# EAGLE design SparkFun_Qwiic_Presence_STHS34PF80 (EAGLE 9.6.2)
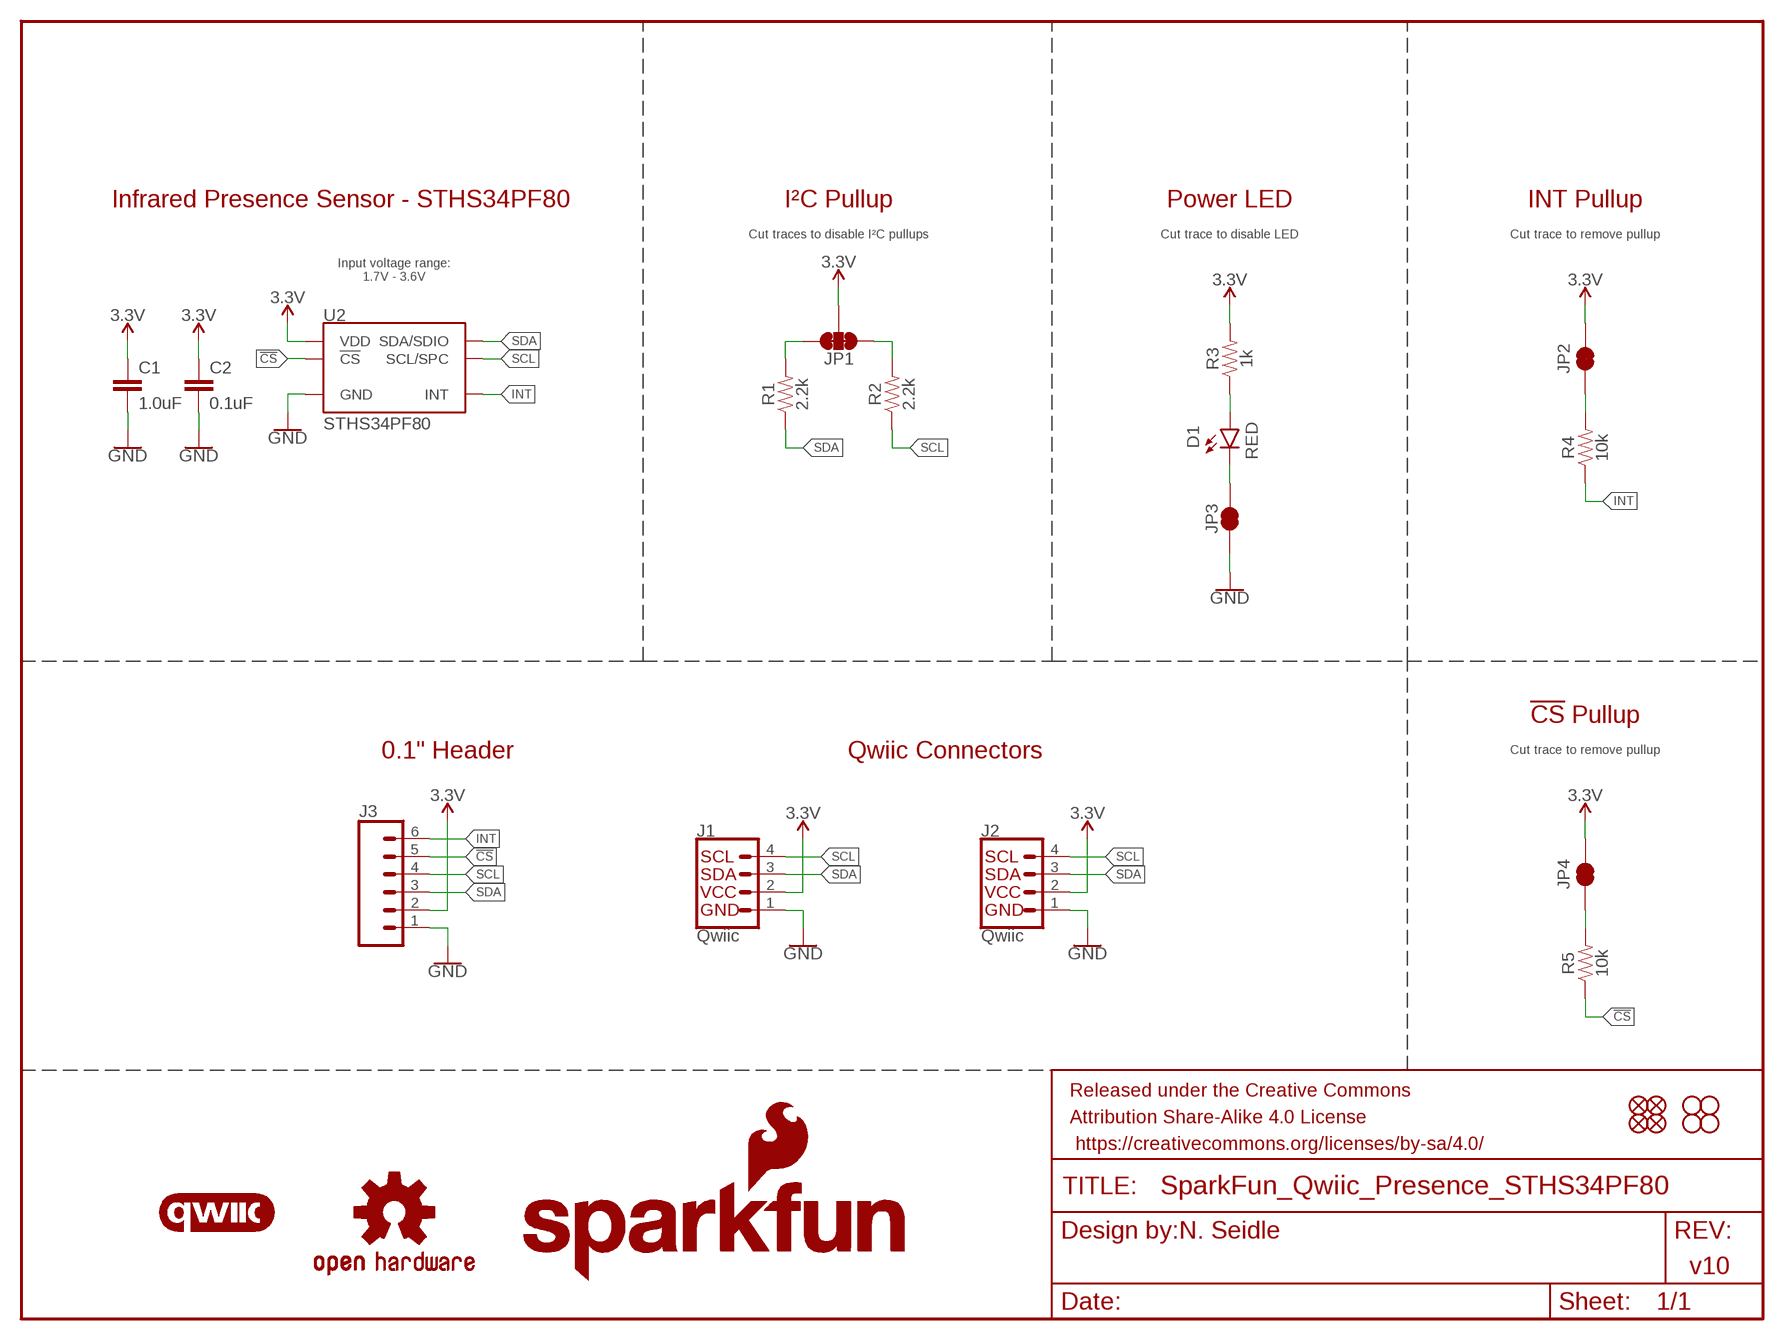
[diagram p0: schematic, sheet 1]

## Parts
C1  1.0uF  1.0UF-0603-16V-10%  [0603]
C2  0.1uF  0.1UF-0603-25V-(+80/-20%)  [0603]
D1  RED  LED-RED0603  [LED-0603]
FD1  FIDUCIAL1X2  [FIDUCIAL-1X2]
FD2  FIDUCIAL1X2  [FIDUCIAL-1X2]
FD3  FIDUCIAL1X2  [FIDUCIAL-1X2]
FD4  FIDUCIAL1X2  [FIDUCIAL-1X2]
FRAME2  FRAME-LETTER  [CREATIVE_COMMONS]
H1  STAND-OFF  [STAND-OFF]
H2  STAND-OFF  [STAND-OFF]
H3  STAND-OFF  [STAND-OFF]
H4  STAND-OFF  [STAND-OFF]
J1  Qwiic  QWIIC_CONNECTORJS-1MM  [JST04_1MM_RA]
J2  Qwiic  QWIIC_CONNECTORJS-1MM  [JST04_1MM_RA]
J3  CONN_06NO_SILK_NO_POP  [1X06_NO_SILK]
JP1  JUMPER-SMT_3_2-NC_TRACE_SILK  [SMT-JUMPER_3_2-NC_TRACE_SILK]
JP2  JUMPER-SMT_2_NC_TRACE_SILK  [SMT-JUMPER_2_NC_TRACE_SILK]
JP3  JUMPER-SMT_2_NC_TRACE_SILK  [SMT-JUMPER_2_NC_TRACE_SILK]
JP4  JUMPER-SMT_2_NC_TRACE_SILK  [SMT-JUMPER_2_NC_TRACE_SILK]
LOGO1  OSHW-LOGOS  [OSHW-LOGO-S]
LOGO2  SFE_LOGO_NAME_FLAME.1_INCH  [SFE_LOGO_NAME_FLAME_.1]
LOGO3  QWIIC_LOGO_CONNECTOR  [QWIIC_5.5MM]
LOGO4  SFE_LOGO_NAME8_MM  [SFE_LOGO_NAME_8MM]
LOGO6  SFE_LOGO_FLAME.1_INCH  [SFE_LOGO_FLAME_.1]
R1  2.2k  2.2KOHM-0603-1/10W-1%  [0603]
R2  2.2k  2.2KOHM-0603-1/10W-1%  [0603]
R3  1k  1KOHM-0603-1/10W-1%  [0603]
R4  10k  10KOHM-0603-1/10W-1%  [0603]
R5  10k  10KOHM-0603-1/10W-1%  [0603]
U2  STHS34PF80  [OLGA-10L]

## Nets
3.3V: C1.1 C2.1 J1.2 J2.2 J3.2 JP1.2 JP2.2 JP4.2 R3.2 U2.6(VDD) U2.9(VDD)
!CS!: J3.5 R5.1 U2.3(!CS!)
GND: C1.2 C2.2 J1.1 J2.1 J3.1 JP3.1 U2.2(GND) U2.7(GND) U2.8(GND)
INT: J3.6 R4.1 U2.10(INT)
N$1: D1.C JP3.2
N$2: JP1.3 R1.2
N$3: JP1.1 R2.2
N$4: D1.A R3.1
N$5: JP2.1 R4.2
N$6: JP4.1 R5.2
SCL: J1.4 J2.4 J3.4 R2.1 U2.1(SCL/SPC)
SDA: J1.3 J2.3 J3.3 R1.1 U2.4(SDA/SDIO)

## Notes on the sheet
- Infrared Presence Sensor - STHS34PF80 | I²C Pullup | Power LED | INT Pullup
- Cut traces to disable I²C pullups | Cut trace to disable LED | Cut trace to remove pullup
- Input voltage range:
  1.7V - 3.6V
- !CS! Pullup
- 0.1" Header | Qwiic Connectors | Cut trace to remove pullup
- N. Seidle
- v10

## Library data of the parts
C1 = SparkFun-Capacitors:1.0UF: 1µF ceramic capacitors A capacitor is a passive two-terminal electrical component used to store electrical energy temporarily in an electric field.; PROD_ID: CAP-00868
C2 = SparkFun-Capacitors:0.1UF: 0.1µF ceramic capacitors A capacitor is a passive two-terminal electrical component used to store electrical energy temporarily in an electric field.; PROD_ID: CAP-00810
D1 = SparkFun-LED:LED-RED: Red SMD LED Used in manufacturing of most products at SparkFun Packages: 0603 - SMD 0603 package [Product Link] <http://docs.avagotech.com/docs/AV02-0551EN> 0603 SMART - SMD 0603 SMART package ( more efficient and expensive)[Product Link] <http://www.osram-os.com/Graphics/XPic2/00077099_0.pdf> 1206 - SMD1206 package [Product Link] <https://www.sparkfun.com/datasheets/DevTools/LilyPad/Q150OVS4.pdff> SparkFun Products: Pro Mini 328 -5V <https://www.sparkfun.com/products/821> RedBoard <https://www.sparkfun.com/products/12757> IOIO-OTG <https://www.sparkfun.com/products/13613>; PROD_ID: DIO-00819
FD1-FD4 = SparkFun-Aesthetics:FIDUCIAL: Fiducial Alignment Points Point-of-reference for pick-and-place machines and other optical instruments.
FRAME2 = SparkFun-Aesthetics:FRAME-LETTER: Schematic Frame - Letter Standard 8.5x11 US Letter frame
H1-H4 = SparkFun-Hardware:STAND-OFF: Stand Off Drill holes for mechanically mounting via screws, standoffs, etc. Note: Use the keepout ring to avoid running the screw head into surrounding components. Variant Overviews STAND-OFF - Mechanical footprint for a #4 phillips button head screw. STAND-OFF-TIGHT - Mechanical footprint for a #4 phillips button head screw, Example SparkFun Products Screw - Phillips Head (1/4", 4-40, 10 pack) <https://www.sparkfun.com/products/10453> (PRT-10453) Screw - Phillips Head (1/2", 4-40, 10 pack) <https://www.sparkfun.com/products/10452> (PRT-10452) Screw - Phillips Head (3/4", 4-40, 10 pack) <https://www.sparkfun.com/products/10451> (PRT-10451) Screw - Phillips Head (1", 4-40, 10 pack) <https://www.sparkfun.com/products/10450> (PRT-10450)
J1 J2 = SparkFun-Connectors:QWIIC_CONNECTOR: SparkFun I2C Standard Qwiic Connector An SMD 1mm pitch JST connector makes it easy and quick (get it? Qwiic?) to connect I2C devices to each other. The Qwiic system <http://www.sparkfun.com/qwiic> enables fast and solderless connection between popular platforms and various sensors and actuators. We carry 200mm <https://www.sparkfun.com/products/14204>, 100mm <https://www.sparkfun.com/products/14205>, 50mm <https://www.sparkfun.com/products/14206>, and breadboard friendly <https://www.sparkfun.com/products/14207> Qwiic cables. We also offer 10 pcs strips <https://www.sparkfun.com/products/14323> the SMD connectors.; PROD_ID: CONN-13694; VALUE: QWIIC_RIGHT_ANGLE
J3 = SparkFun-Connectors:CONN_06: Multi connection point. Often used as Generic Header-pin footprint for 0.1 inch spaced/style header connections On any of the 0.1 inch spaced packages, you can populate with these: Break Away Headers - Straight <https://www.sparkfun.com/products/116> (PRT-00116) Break Away Male Headers - Right Angle <https://www.sparkfun.com/products/553> (PRT-00553) Female Headers <https://www.sparkfun.com/products/115> (PRT-00115) Break Away Headers - Machine Pin <https://www.sparkfun.com/products/117> (PRT-00117) Break Away Female Headers - Swiss Machine Pin <https://www.sparkfun.com/products/743> (PRT-00743) Arduino Stackable Header - 6 Pin <https://www.sparkfun.com/products/9280> (PRT-09280) Screw Terminals 2.54mm Pitch (6-Pin) <https://www.sparkfun.com/products/16499> (PRT-16499) For SCREWTERMINALS and SPRING TERMINALS visit here: Screw Terimnals on SparkFun.com <https://www.sparkfun.com/search/results?term=Screw+Terminals> (5mm/3.5mm/2.54mm spacing) This device is also useful as a general connection point to wire up your design to another part of your project. Our various solder wires solder well into these plated through hole pads. Hook-Up Wire - Assortment (Stranded, 22 AWG) <https://www.sparkfun.com/products/11375> (PRT-11375) Hook-Up Wire - Assortment (Solid Core, 22 AWG) <https://www.sparkfun.com/products/11367> (PRT-11367) View the entire wire category on our website here <https://www.sparkfun.com/categories/141>
JP1 = SparkFun-Jumpers:JUMPER-SMT_3_2-NC_TRACE: Normally closed trace jumper (2 of 2 connections) This jumper has a trace between all three pads so they are normally closed (NC). Use a razor knife to open the connection(s). For best results follow the IPC guidelines for cutting traces: Cutout at least 0.063 mm (0.005 in). Remove all loose material to clean up the cut area. Seal the cut with an approved epoxy. Reapply solder to reclose the connection(s).
JP2-JP4 = SparkFun-Jumpers:JUMPER-SMT_2_NC_TRACE: Normally closed trace jumper This jumper has a trace between two pads so it's normally closed (NC). Use a razor knife to open the connection. For best results follow the IPC guidelines for cutting traces: Cutout at least 0.063 mm (0.005 in). Remove all loose material to clean up the cut area. Seal the cut with an approved epoxy. Reapply solder to reclose the connection.
LOGO1 = SparkFun-Aesthetics:OSHW-LOGO: Open-Source Hardware (OSHW) Logo This logo indicates the piece of hardware it is found on incorporates a OSHW license and/or adheres to the definition of open source hardware found here: http://freedomdefined.org/OSHW
LOGO2 = SparkFun-Aesthetics:SFE_LOGO_NAME_FLAME: SparkFun Font Logo w/ Flame This is the SparkFun full logo. The logo on the schematic will always be the same size; the package variant is the height of the flame part of the logo. Default layer for the logo on the board is tSilk.
LOGO3 = SparkFun-Aesthetics:QWIIC_LOGO: Qwiic Logos for placement on schematic and PCB. The 5.5mm silk logo is best for placing next to Qwiic connector.
LOGO4 = SparkFun-Aesthetics:SFE_LOGO_NAME: SparkFun Font Logo This is the SparkFun name logo. The logo on the schematic will always be the same size; the package variant is the height of the flame part of the logo (or the height the flame would be, if it were drawn). Default layer for the logo on the board is tSilk.
LOGO6 = SparkFun-Aesthetics:SFE_LOGO_FLAME: SparkFun Flame Logo This is the SparkFun flame logo. The logo on the schematic will always be the same size; the package variant is the height of the flame. Default layer for the logo on the board is tSilk.
R1 R2 = SparkFun-Resistors:2.2KOHM: 2.2kΩ resistor A resistor is a passive two-terminal electrical component that implements electrical resistance as a circuit element. Resistors act to reduce current flow, and, at the same time, act to lower voltage levels within circuits. - Wikipedia; PROD_ID: RES-08272
R3 = SparkFun-Resistors:1KOHM: 1kΩ resistor A resistor is a passive two-terminal electrical component that implements electrical resistance as a circuit element. Resistors act to reduce current flow, and, at the same time, act to lower voltage levels within circuits. - Wikipedia; PROD_ID: RES-07856
R4 R5 = SparkFun-Resistors:10KOHM: 10kΩ resistor A resistor is a passive two-terminal electrical component that implements electrical resistance as a circuit element. Resistors act to reduce current flow, and, at the same time, act to lower voltage levels within circuits. - Wikipedia; PROD_ID: RES-00824
U2 = STHS34PF80:STHS34PF80: Bosch BMP384 Pressure Sensor Senses pressure from 300 hPa to 1250 hPa, sends data out over I2C or SPI; PROD_ID: IC-

## Board
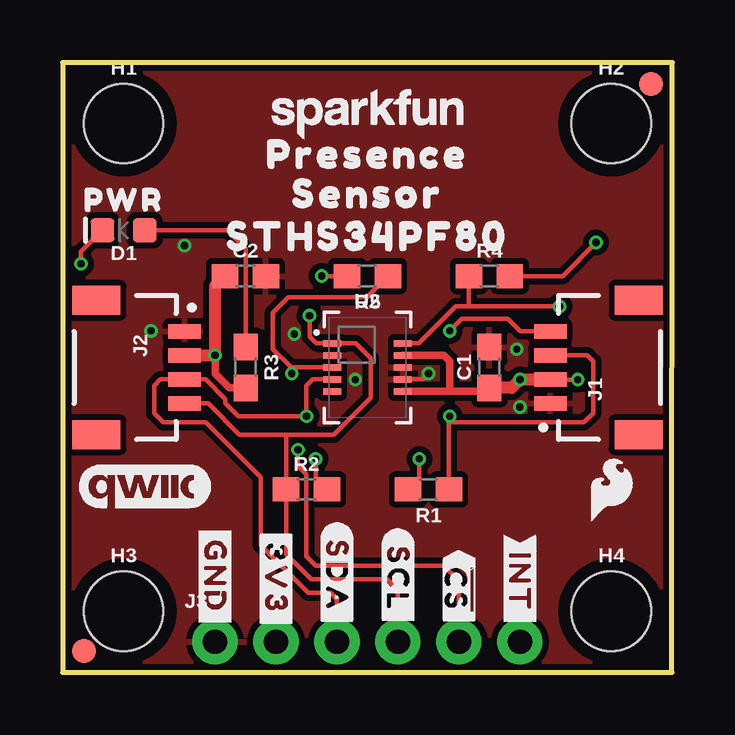
[diagram p1: board, top side]
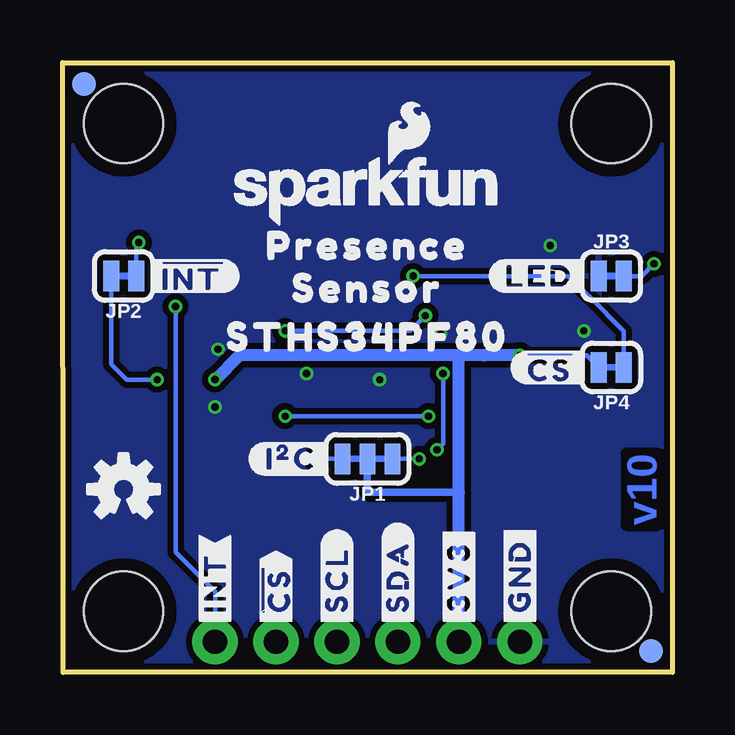
[diagram p2: board, bottom side, seen from below]

Size 25.4 x 25.4 mm. Coordinates in mm from the lower left corner, seen from the top.
Outline: 0,0 25.38,0 25.4,25.4 0,25.4 0,0
Copper layers (1*16): Top 0.035mm / dielectric 1.5mm / Bottom 0.035mm
Design rules "SparkFun-2-Layer-Minimum-JLCPCB": minimum track width 5mil, minimum drill 0.3mm, track to track 5mil, track to pad 5mil, pad to pad 5mil, via to via 5mil, smd to smd 5mil, copper to edge 7mil, drill to drill 7mil, minimum pad ring 5mil, minimum via ring 5mil, stop-mask expansion 2.5mil, vias tented up to drill 25mil, thermal gap 10mil

### Footprints (pad centres in the part's own frame; a part is rotated, then mirrored left to right if it is on the bottom)
0603 = smd 1.1 x 1: 1 -0.85,0; 2 0.85,0
LED-0603 = smd 1 x 1: A -0.877,0; C 0.877,0
FIDUCIAL-1X2 = smd 1 x 1: 1 0,0
STAND-OFF = hole 3.302: 0,0
JST04_1MM_RA = smd 0.6 x 1.35: 1 -1.5,0; 2 -0.5,0; 3 0.5,0; 4 1.5,0 | smd 1.2 x 2: NC1 2.8,-3.675; NC2 -2.8,-3.675
1X06_NO_SILK = drill 1.016 pad 1.88: 1 0,0; 2 2.54,0; 3 5.08,0; 4 7.62,0; 5 10.16,0; 6 12.7,0
SMT-JUMPER_3_2-NC_TRACE_SILK = smd 0.66 x 1.27: 1 -1.041,0; 2 0,0; 3 1.041,0
SMT-JUMPER_2_NC_TRACE_SILK = smd 0.66 x 1.27: 1 -0.521,0; 2 0.521,0
OLGA-10L = smd 0.75 x 0.285: 1 -1.475,1; 2 -1.475,0.5; 3 -1.475,0; 4 -1.475,-0.5; 5 -1.475,-1; 6 1.475,-1; 7 1.475,-0.5; 8 1.475,0; 9 1.475,0.5; 10 1.475,1

### Placement (x,y rotation side)
C1  17.78,12.7 90 top
C2  7.62,16.51 0 top
D1  2.54,18.41 180 top
FD1  0.89,0.89 0 bottom
FD2  0.89,0.89 0 top
FD3  24.51,24.51 0 bottom
FD4  24.51,24.51 0 top
FRAME2  -10.16,-29.21 0 top  (outside the outline)
H1  2.54,22.86 0 top
H2  22.86,22.86 0 top
H3  2.54,2.54 0 top
H4  22.86,2.54 0 top
J1  20.32,12.7 90 top
J2  5.08,12.7 270 top
J3  6.35,1.27 0 top
JP1  12.7,8.89 180 bottom
JP2  22.86,16.51 180 bottom
JP3  2.54,16.51 0 bottom
JP4  2.54,12.7 180 bottom
LOGO1  22.86,7.62 0 bottom
LOGO2  12.7,20.07 0 bottom
LOGO3  3.43,7.75 0 top
LOGO4  12.7,23.37 0 top
LOGO6  22.86,7.62 0 top
R1  15.24,7.62 180 top
R2  10.16,7.62 0 top
R3  7.62,12.7 270 top
R4  17.78,16.51 0 top
R5  12.7,16.51 180 top
U2  12.7,12.7 0 top
U$1  [#I�C#0]  17.65,8.89 0 bottom
U$2  [##CS##0]  16.51,1.78 90 bottom
U$3  [#3V3#0]  8.89,1.78 90 bottom
U$4  [#INT#1]  19.05,1.78 90 bottom
U$5  [STHS34PF800]  12.7,18.16 0 top
U$6  [STHS34PF800]  12.7,13.97 0 bottom
U$7  [PRESENCE0]  12.7,21.59 0 top
U$8  [PRESENCE0]  12.7,17.78 0 bottom
U$9  [PWR11]  2.54,19.68 0 top
U$10  [##INT##0]  21.97,16.51 0 bottom
U$11  [#SDA#0]  11.43,6.22 270 top
U$12  [SENSOR1]  12.7,19.94 0 top
U$13  [##CS##1]  16.51,5.08 270 top
U$14  [SENSOR1]  12.7,16 0 bottom
U$15  [#INT#2]  19.05,5.71 270 top
U$16  [#GND#4]  6.35,6.22 270 top
U$17  [#LED#10]  3.43,16.51 0 bottom
U$18  [#GND#4]  6.35,1.78 90 bottom
U$19  [#3V3#0]  8.89,6.1 270 top
U$20  [#SDA#5]  11.43,1.78 90 bottom
U$21  [#SCL#6]  13.97,1.78 90 bottom
U$22  [#SCL#0]  13.97,5.97 270 top
U$23  [##CS#0]  6.73,12.7 0 bottom

### Tracks (layer width: path | path; a pad name or v marks a point on that pad's centre or on a via)
3.3V  (via drill 0.3)
  Top 0.178: v21.46,12.19 J1.2
  Top 0.305: U2.6 16.13,11.7 | 16.13,11.7 17.63,11.7 C1.1 | U2.9 15.88,13.2 16.13,12.95 16.13,11.7 | R3.2 6.95,11.85 6.35,12.45 v6.35,13.21
  Top 0.508: J2.2 v6.35,13.21 6.35,16.09 C2.1 | J1.2 v19.06,12.2 v19.05,12.19 18.71,11.85 C1.1
  Bottom 0.178: JP2.2 23.38,12.84 22.73,12.19 v21.46,12.19 | JP4.2 3.57,13.21 v6.35,13.21
  Bottom 0.305: JP1.2 12.7,7.62 12.57,7.49 8.89,7.49
  Bottom 0.508: v6.35,13.21 7.87,13.21 8.76,13.21 | 8.76,13.21 18.03,13.21 v19.05,12.19 | J3.2 8.89,7.49 8.89,13.08 8.76,13.21
!CS!  (via drill 0.3)
  Top 0.178: U2.3 9.65,12.7 | v9.8,9.27 9.8,8.61 10.16,8.26 10.16,4.83 10.54,4.45 15.88,4.45 16.51,3.81 J3.5 | 9.65,12.7 9.53,12.7 8.76,13.46 8.76,14.99 9.4,15.62 12.66,15.62 R5.1 | v9.55,12.45 9.55,12.6 9.65,12.7
  Bottom 0.178: v9.55,12.45 9.55,9.53 v9.8,9.27
GND  (via drill 0.3)
  Top 0.178: U2.7 14.99,12.2 v15.24,12.45
  other vias: 3.68,14.22 9.65,14.1 18.92,13.46 19.05,11.05 5.08,17.78 12.19,12.19
  pour Top (isolate 0.254): 0,0 0,25.4 25.4,25.4 25.4,0
  pour Bottom (isolate 0.254): 0,25.4 25.4,25.4 25.4,0 0,0
INT  (via drill 0.3)
  Top 0.178: U2.10 14.84,13.7 16.38,15.24 16.89,15.24 | v20.7,15.24 16.89,15.24 | 16.89,15.24 16.93,15.28 R4.1
  Bottom 0.178: J3.6 19.05,3.36 20.69,5 20.69,15.23 v20.7,15.24
N$1  (via drill 0.3)
  Top 0.178: v0.76,17.02 0.76,17.51 D1.C
  Bottom 0.178: JP3.2 1.27,16.51 v0.76,17.02
N$2  (via drill 0.3)
  Top 0.178: v14.86,8.89 14.86,8.09 R1.2
  Bottom 0.178: JP1.3 v14.86,8.89
N$3  (via drill 0.3)
  Top 0.178: v10.54,8.89 10.54,8.09 R2.2
  Bottom 0.178: JP1.1 v10.54,8.89
N$4
  Top 0.178: D1.A 5.46,18.41 6.86,18.41 7.62,17.65 R3.1
N$5  (via drill 0.3)
  Top 0.178: R4.2 20.83,16.51 v22.23,17.91
  Bottom 0.178: JP2.1 22.34,17.79 v22.23,17.91
N$6  (via drill 0.3)
  Top 0.178: R5.2 v10.79,16.51
  Bottom 0.178: v10.79,16.51 4.33,16.51 3.48,15.66 3.47,15.66 2.02,14.21 JP4.1
SCL  (via drill 0.3)
  Top 0.178: J2.4 6.07,11.2 7.37,9.91 9.27,9.91 | 9.27,9.91 11.3,9.91 12.83,11.43 12.83,13.08 12.21,13.7 U2.1 10.56,13.7 10.29,13.97 v10.29,14.86 | J1.4 19.07,14.2 18.54,14.73 16.64,14.73 v16.13,14.22 | J3.4 13.97,3.43 13.53,3.87 10.35,3.87 9.31,4.91 R2.1 9.31,9.87 9.27,9.91
  Bottom 0.178: v16.13,14.22 10.92,14.22 v10.29,14.86
SDA  (via drill 0.3)
  Top 0.178: J1.3 21.85,13.2 22.1,12.95 22.1,10.79 21.72,10.41 16.22,10.41 16.09,10.54 | R1.1 16.09,10.54 | 16.09,10.54 16.09,10.63 v16.13,10.67 | U2.4 10.42,12.2 10.16,11.94 v10.16,10.67 7.32,10.67 6.78,11.21 6.78,11.38 5.96,12.2 J2.3 4.07,12.2 3.81,11.94 3.81,10.79 4.19,10.41 5.97,10.41 8.26,8.13 8.26,5.28 10.22,3.31 11.16,3.31 11.43,3.05 J3.3
  Bottom 0.178: v16.13,10.67 v10.16,10.67

### Text on the board
Bottom: v10
Measures: Units: inches
tDocu: N. Seidle